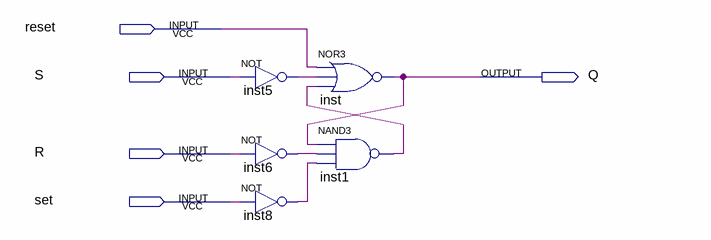
[diagram p0: schematic sheet]
// Quartus schematic latch_SR_sr.bdf as structural Verilog: 5 symbols, 5 pins
module latch_SR_sr (
  input  reset,
  input  S,
  input  R,
  input  set,
  output Q
);

  wire inst1_out, inst5_out, inst6_out, inst8_out;

  not inst5 (inst5_out, S);
  not inst6 (inst6_out, R);
  not inst8 (inst8_out, set);
  nor inst (Q, reset, inst5_out, inst1_out);
  nand inst1 (inst1_out, Q, inst6_out, inst8_out);
endmodule
